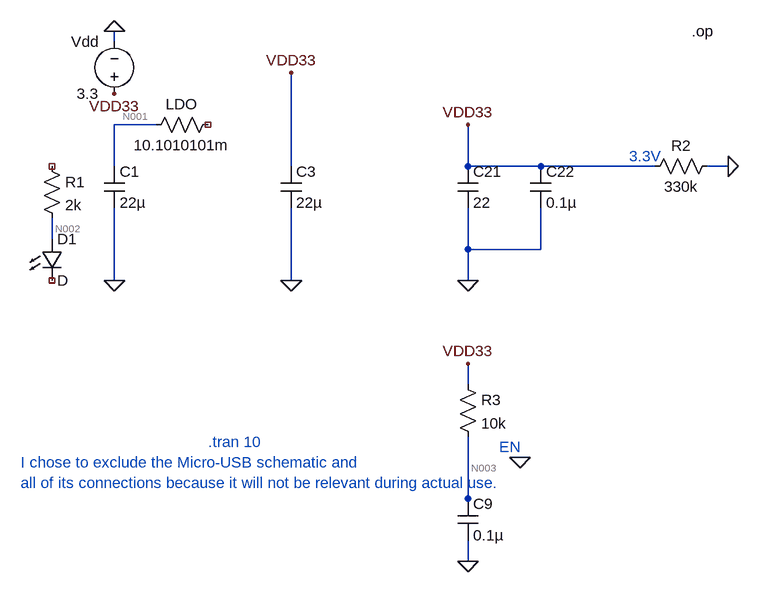
[diagram p0: schematic ESP32DevKitCv4_WROVER-E_Ltspice.asc]
ESP32DevKitCv4_WROVER-E_Ltspice.asc, the LTspice schematic file:
Version 4.1
SHEET 1 884 724
WIRE -80 -96 -80 -112
WIRE -16 32 -80 32
WIRE -80 96 -80 32
WIRE 192 96 192 -48
WIRE 464 96 464 32
WIRE 576 96 464 96
WIRE 752 96 576 96
WIRE 864 96 832 96
WIRE -176 208 -176 176
WIRE 464 224 464 160
WIRE 576 224 576 160
WIRE 576 224 464 224
WIRE -80 272 -80 160
WIRE 192 272 192 160
WIRE 464 272 464 224
WIRE 464 432 464 400
WIRE 464 608 464 512
WIRE 464 624 464 608
WIRE 464 704 464 672
FLAG -80 272 0
FLAG -80 -112 0
FLAG 192 272 0
FLAG 192 -48 VDD33
FLAG 464 272 0
FLAG 464 32 VDD33
FLAG 464 400 VDD33
FLAG 464 704 0
FLAG 544 544 0
FLAG 864 96 0
FLAG -80 -16 VDD33
SYMBOL res 80 16 R90
WINDOW 0 0 56 VBottom 2
WINDOW 3 32 56 VTop 2
SYMATTR InstName LDO
SYMATTR Value 10.1010101m
SYMBOL res -192 80 R0
SYMATTR InstName R1
SYMATTR Value 2k
SYMATTR SpiceLine tol=5
SYMBOL LED -192 208 R0
SYMATTR InstName D1
SYMBOL cap -96 96 R0
SYMATTR InstName C1
SYMATTR Value 22µ
SYMATTR SpiceLine V=10
SYMBOL voltage -80 0 R180
WINDOW 0 24 96 Left 2
WINDOW 3 24 16 Left 2
WINDOW 123 0 0 Left 0
WINDOW 39 0 0 Left 0
SYMATTR InstName Vdd
SYMATTR Value 3.3
SYMBOL cap 176 96 R0
SYMATTR InstName C3
SYMATTR Value 22µ
SYMATTR SpiceLine V=10
SYMBOL cap 448 96 R0
SYMATTR InstName C21
SYMATTR Value 22
SYMATTR SpiceLine V=50
SYMBOL cap 560 96 R0
SYMATTR InstName C22
SYMATTR Value 0.1µ
SYMATTR SpiceLine V=50
SYMBOL res 848 80 R90
WINDOW 0 0 56 VBottom 2
WINDOW 3 32 56 VTop 2
SYMATTR InstName R2
SYMATTR Value 330k
SYMBOL res 448 416 R0
SYMATTR InstName R3
SYMATTR Value 10k
SYMATTR SpiceLine tol=5
SYMBOL cap 448 608 R0
SYMATTR InstName C9
SYMATTR Value 0.1µ
SYMATTR SpiceLine V=50
TEXT 512 528 Left 2 ;EN
TEXT 712 80 Left 2 ;3.3V
TEXT 64 520 Left 2 ;.tran 10
TEXT -224 552 Left 2 ;I chose to exclude the Micro-USB schematic and\nall of its connections because it will not be relevant during actual use.
TEXT 808 -112 Left 2 !.op

The netlist it stands for:
* ESP32DevKitCv4_WROVER-E_Ltspice.asc
R§LDO NC_01 N001 10.1010101m
R1 NC_02 N002 2k tol=5
D1 N002 NC_03 D
C1 N001 0 22µ V=10
Vdd VDD33 0 3.3
C3 VDD33 0 22µ V=10
C21 VDD33 0 22 V=50
C22 VDD33 0 0.1µ V=50
R2 0 VDD33 330k
R3 VDD33 N003 10k tol=5
C9 N003 0 0.1µ V=50
.model D D
.lib standard.dio
* EN
* 3.3V
* .tran 10
* I chose to exclude the Micro-USB schematic and
* all of its connections because it will not be relevant during actual use.
.op
.backanno
.end

* Results of the author's LTspice run, read from the files saved beside the schematic
* Operating Point:
*   V(n001) = 0 V
*   V(n002) = 0 V
*   V(n003) = 3.3 V
*   V(vdd33) = 3.3 V
*   I(C1) = 0 A
*   I(C21) = 72.6 pA
*   I(C22) = 0 A
*   I(C3) = 0 A
*   I(C9) = 0 A
*   I(D1) = 0 A
*   I(LDO) = 0 A
*   I(R1) = 0 A
*   I(R2) = -10 µA
*   I(R3) = 0 A
*   I(Vdd) = -10 µA